# EAGLE schematic CAA-NMC_variants (EAGLE 9.2.2)
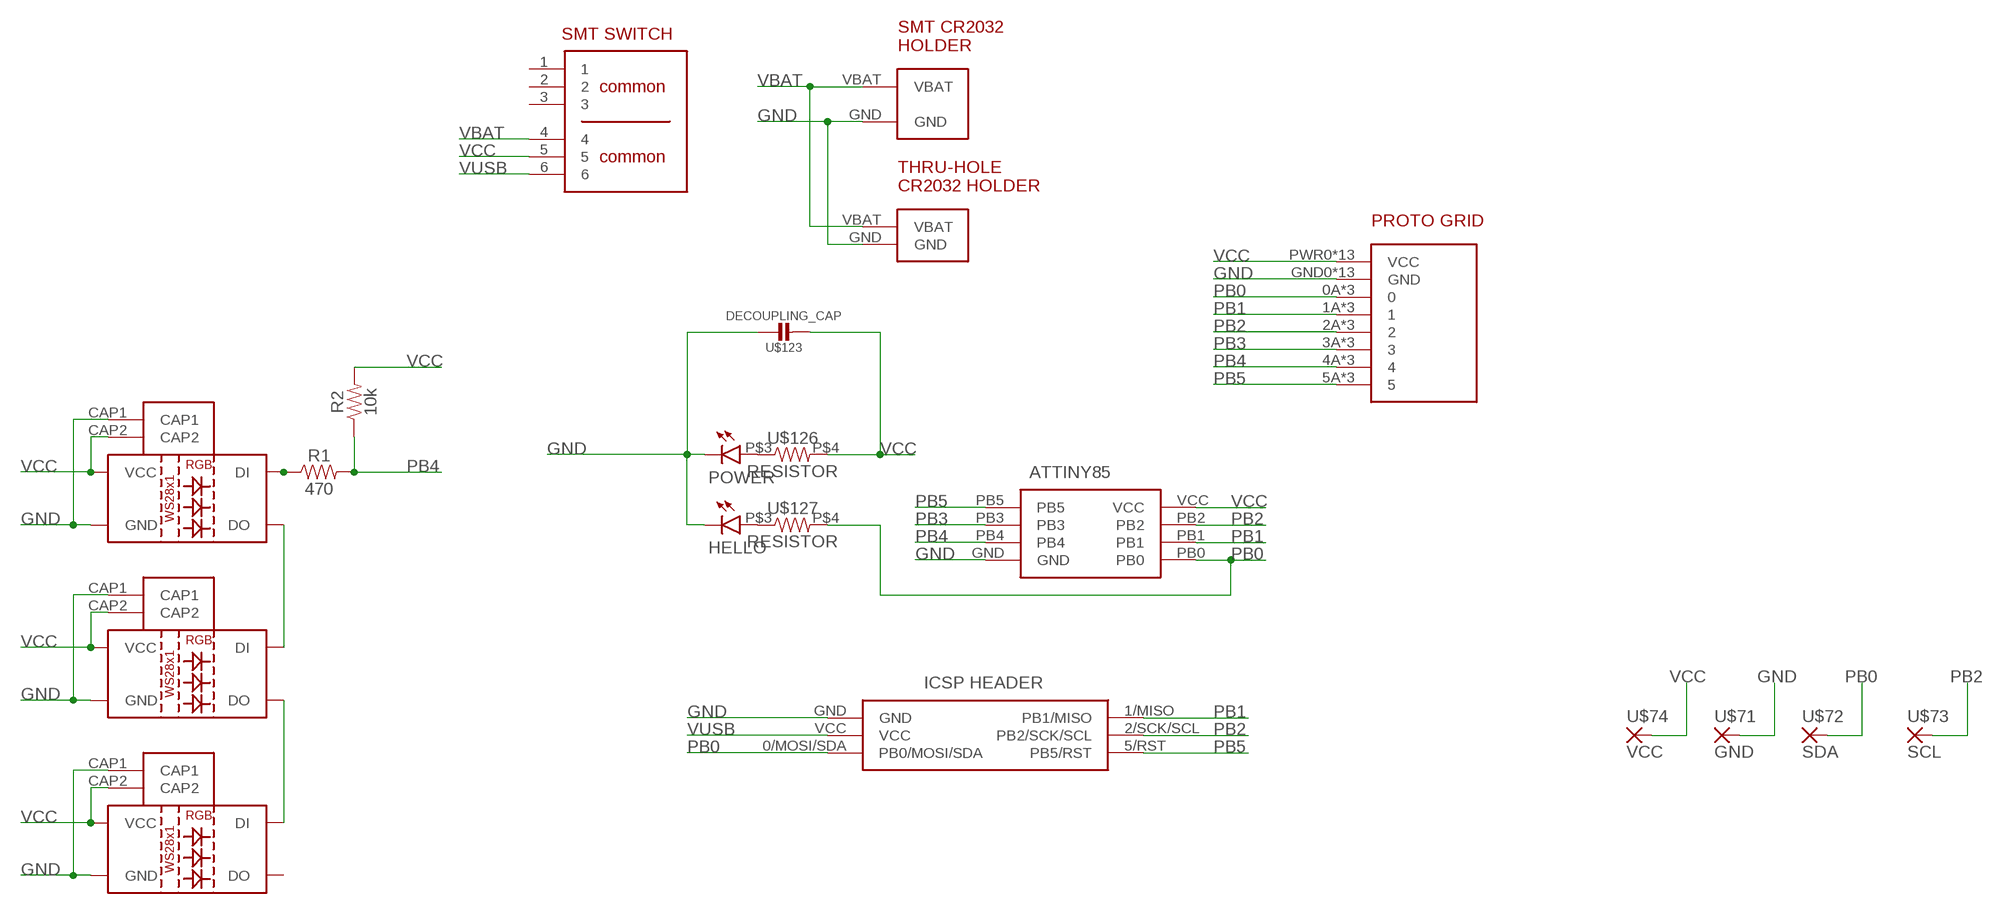
[diagram p0: schematic, sheet 1]

## Parts
D1  WS2812B  [WS2812B]
D2  WS2812B  [WS2812B]
D3  WS2812B  [WS2812B]
HELLO  LED3MM  [LED3MM]
IC1  ATTINY85-20SU  [SOT127P798X216-8N]
J1  M20-9980346  [HDRV6W64P254_2X3_762X508X868P]
POWER  LED3MM  [LED3MM]
R1  470  470OHM-0603-1/10W-1%  [0603]
R2  10k  10KOHM-0603-1/10W-1%  [0603]
U$1  PROTO  [PROTO]
U$2  SMT-BATTERY-HOLDER  [SMT-CR-HOLDER]
U$3  THRU-CR-HOLDER  [THRU-CR-HOLDER]
U$71  GND  ONE_PAD  [1X01]
U$72  SDA  ONE_PAD  [1X01]
U$73  SCL  ONE_PAD  [1X01]
U$74  VCC  ONE_PAD  [1X01]
U$123  DECOUPLING_CAP  [DECOUPLING_CAP]
U$126  RESISTOR  [AXIAL-0.3]
U$127  RESISTOR  [AXIAL-0.3]
U$145  SMT-SWITCH  [SMT-SWITCH]

## Nets
GND [GND]: D1.CAP1 D1.GND D2.CAP1 D2.GND D3.CAP1 D3.GND HELLO.NEG IC1.GND J1.GND POWER.NEG U$1.GND0(GND) U$1.GND1(GND) U$1.GND2(GND) U$1.GND3(GND) U$1.GND4(GND) U$1.GND5(GND) U$1.GND6(GND) U$1.GND7(GND) U$1.GND8(GND) U$1.GND9(GND) U$1.GND10(GND) U$1.GND11(GND) U$1.GND12(GND) U$2.GND U$3.GND U$71.P$1(P) U$123.P$1
N$1: POWER.POS U$126.P$3
N$2: HELLO.POS U$127.P$3
N$3: D1.DO D2.DI
N$4: D2.DO D3.DI
N$5: D1.DI R1.1
PB0: IC1.PB0 J1.0/MOSI/SDA(PB0/MOSI/SDA) U$1.0A U$1.0B U$1.0C U$72.P$1(P) U$127.P$4
PB1: IC1.PB1 J1.1/MISO(PB1/MISO) U$1.1A U$1.1B U$1.1C
PB2: IC1.PB2 J1.2/SCK/SCL(PB2/SCK/SCL) U$1.2A U$1.2B U$1.2C U$73.P$1(P)
PB3: IC1.PB3 U$1.3A U$1.3B U$1.3C
PB4: IC1.PB4 R1.2 R2.1 U$1.4A U$1.4B U$1.4C
PB5: IC1.PB5 J1.5/RST(PB5/RST) U$1.5A U$1.5B U$1.5C
VBAT: U$2.VBAT U$3.VBAT U$145.4
VCC [VCC]: D1.CAP2 D1.VCC D2.CAP2 D2.VCC D3.CAP2 D3.VCC IC1.VCC R2.2 U$1.PWR0(VCC) U$1.PWR1(VCC) U$1.PWR2(VCC) U$1.PWR3(VCC) U$1.PWR4(VCC) U$1.PWR5(VCC) U$1.PWR6(VCC) U$1.PWR7(VCC) U$1.PWR8(VCC) U$1.PWR9(VCC) U$1.PWR10(VCC) U$1.PWR11(VCC) U$1.PWR12(VCC) U$74.P$1(P) U$123.P$2 U$126.P$4 U$145.5
VUSB: J1.VCC U$145.6
Unconnected: D3.DO U$145.1 U$145.2 U$145.3

## Library data of the parts
D1-D3 = BadgeParts:WS2812B: WS2812B SMD addressable RGB LED 5x5mm SMD LED with built-in controller IC. Color: Red/Green/Blue mC Rating: RGB: 390, 660, 180 mcd Forward Voltage: RGB: 2.0, 3.0, 3.0 V Packages:WS2812B SparkFun Products: Blynk Board - ESP8266 <https://www.sparkfun.com/products/13794>; PROD_ID: DIO-12503
HELLO POWER = BadgeParts:LED3MM
IC1 = BadgeParts:ATTINY85-20SU: MICROCHIP - ATTINY85-20SU - MICROCONTROLLER MCU, 8 BIT, ATTINY, 20MHZ, SOIC-8 Source: Datasheet <https://componentsearchengine.com/Datasheets/2/ATTINY85-20SU.pdf>; ARROW_PART_NUMBER: ATTINY85-20SU; ARROW_PRICE/STOCK: https://www.arrow.com/en/products/attiny85-20su/microchip-technology; DESCRIPTION: MICROCHIP - ATTINY85-20SU - MICROCONTROLLER MCU, 8 BIT, ATTINY, 20MHZ, SOIC-8; HEIGHT: 2.16mm; MANUFACTURER_NAME: Microchip; MANUFACTURER_PART_NUMBER: ATTINY85-20SU; RS_PART_NUMBER: 1331674; RS_PRICE/STOCK: http://uk.rs-online.com/web/p/products/1331674
J1 = BadgeParts:M20-9980346: 03+03 DIL Vertical Pin Header HARWIN M20 Series, 2.54mm Pitch 6 Way 2 Row Straight PCB Header, Solder Termination, 3A Source: Datasheet <https://cdn.harwin.com/pdfs/M20-998.pdf?utm_source=3D_PDF&utm_medium=3D_PDF&utm_campaign=3D_PDF>; ARROW_PART_NUMBER: M20-9980346; ARROW_PRICE/STOCK: http://uk.rs-online.com/web/p/products/7457046P; DESCRIPTION: 03+03 DIL Vertical Pin Header HARWIN M20 Series, 2.54mm Pitch 6 Way 2 Row Straight PCB Header, Solder Termination, 3A; HEIGHT: 8.68mm; MANUFACTURER_NAME: HARWIN; MANUFACTURER_PART_NUMBER: M20-9980346; RS_PART_NUMBER: 7457046P; RS_PRICE/STOCK: http://uk.rs-online.com/web/p/products/7457046P
R1 = SparkFun-Resistors:470OHM: 470Ω resistor A resistor is a passive two-terminal electrical component that implements electrical resistance as a circuit element. Resistors act to reduce current flow, and, at the same time, act to lower voltage levels within circuits. - Wikipedia; PROD_ID: RES-07869
R2 = SparkFun-Resistors:10KOHM: 10kΩ resistor A resistor is a passive two-terminal electrical component that implements electrical resistance as a circuit element. Resistors act to reduce current flow, and, at the same time, act to lower voltage levels within circuits. - Wikipedia; PROD_ID: RES-00824
U$1 = BadgeParts:PROTO
U$2 = BadgeParts:SMT-BATTERY-HOLDER
U$3 = BadgeParts:THRU-CR-HOLDER
U$71-U$74 = BadgeParts:ONE_PAD
U$123 = BadgeParts:DECOUPLING_CAP
U$126 U$127 = BadgeParts:RESISTOR
U$145 = BadgeParts:SMT-SWITCH

## Net classes
0 default: width 0.254 mm, clearance 0.254 mm
1 VCC: width 0.381 mm, clearance 0.254 mm
2 GND: width 0.381 mm, clearance 0.254 mm